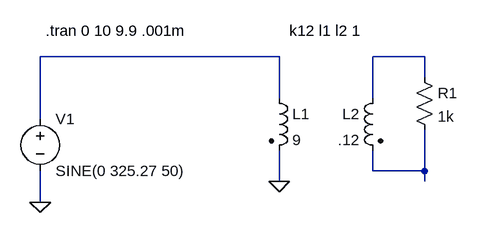
[diagram p0: schematic trafo3.ssc.asc]
trafo3.ssc.asc, the LTspice schematic file:
Version 4
SHEET 1 880 680
WIRE 208 48 -160 48
WIRE 432 48 352 48
WIRE 432 80 432 48
WIRE 208 112 208 48
WIRE 352 112 352 48
WIRE -160 144 -160 48
WIRE 352 224 352 192
WIRE 432 224 432 160
WIRE 432 224 352 224
WIRE 208 240 208 192
WIRE 432 240 432 224
WIRE -160 272 -160 224
FLAG 208 240 0
FLAG -160 272 0
SYMBOL voltage -160 128 R0
WINDOW 123 0 0 Left 0
WINDOW 39 0 0 Left 0
SYMATTR InstName V1
SYMATTR Value SINE(0 325.27 50)
SYMBOL ind2 192 96 R0
SYMATTR InstName L1
SYMATTR Value 9
SYMATTR SpiceLine Rser=0.1
SYMBOL ind2 368 96 M0
SYMATTR InstName L2
SYMATTR Value .12
SYMBOL res 416 64 R0
SYMATTR InstName R1
SYMATTR Value 1k
TEXT -152 8 Left 2 !.tran 0 10 9.9 .001m
TEXT 224 8 Left 2 !k12 l1 l2 1

The netlist it stands for:
* trafo3.ssc.asc
V1 N001 0 SINE(0 325.27 50)
L1 N001 0 9 Rser=0.1
L2 N002 N003 .12
R1 N002 N003 1k
.tran 0 10 9.9 .001m
k12 l1 l2 1
.backanno
.end